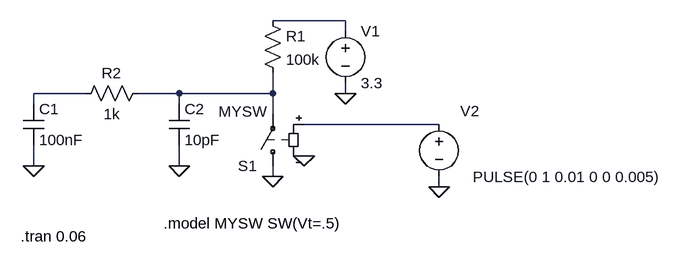
[diagram p0: schematic button_open.asc]
button_open.asc, the LTspice schematic file:
Version 4
SHEET 1 1192 680
WIRE 608 16 496 16
WIRE 608 32 608 16
WIRE 208 128 128 128
WIRE 352 128 288 128
WIRE 496 128 496 96
WIRE 496 128 352 128
WIRE 608 128 608 112
WIRE 128 144 128 128
WIRE 352 144 352 128
WIRE 496 160 496 128
WIRE 752 176 544 176
WIRE 128 240 128 208
WIRE 352 240 352 208
WIRE 496 256 496 240
WIRE 752 272 752 256
FLAG 352 240 0
FLAG 128 240 0
FLAG 496 256 0
FLAG 608 128 0
FLAG 544 224 0
FLAG 752 272 0
SYMBOL cap 112 144 R0
SYMATTR InstName C1
SYMATTR Value 100nF
SYMBOL cap 336 144 R0
SYMATTR InstName C2
SYMATTR Value 10pF
SYMBOL res 480 0 R0
SYMATTR InstName R1
SYMATTR Value 100k
SYMBOL res 304 112 R90
WINDOW 0 0 56 VBottom 2
WINDOW 3 32 56 VTop 2
SYMATTR InstName R2
SYMATTR Value 1k
SYMBOL voltage 608 16 R0
WINDOW 123 0 0 Left 0
WINDOW 39 0 0 Left 0
SYMATTR InstName V1
SYMATTR Value 3.3
SYMBOL sw 496 256 R180
WINDOW 3 9 100 Left 2
SYMATTR InstName S1
SYMATTR Value MYSW
SYMBOL voltage 752 160 M0
WINDOW 0 -62 -5 Left 2
WINDOW 3 -342 97 Left 2
WINDOW 123 0 0 Left 0
WINDOW 39 0 0 Left 0
SYMATTR InstName V2
SYMATTR Value PULSE(0 1 0.01 0 0 0.005)
TEXT 328 328 Left 2 !.model MYSW SW(Vt=.5)
TEXT 108 348 Left 2 !.tran 0.06

The netlist it stands for:
* button_open.asc
C1 N002 0 100nF
C2 N003 0 10pF
R1 N001 N003 100k
R2 N003 N002 1k
V1 N001 0 3.3
S1 0 N003 N004 0 MYSW
V2 N004 0 PULSE(0 1 0.01 0 0 0.005)
.model MYSW SW(Vt=.5)
.tran 0.06
.backanno
.end